# Altium schematic sheet USB.SchDoc
size A4; SheetNumber: 7; SheetTotal: 10
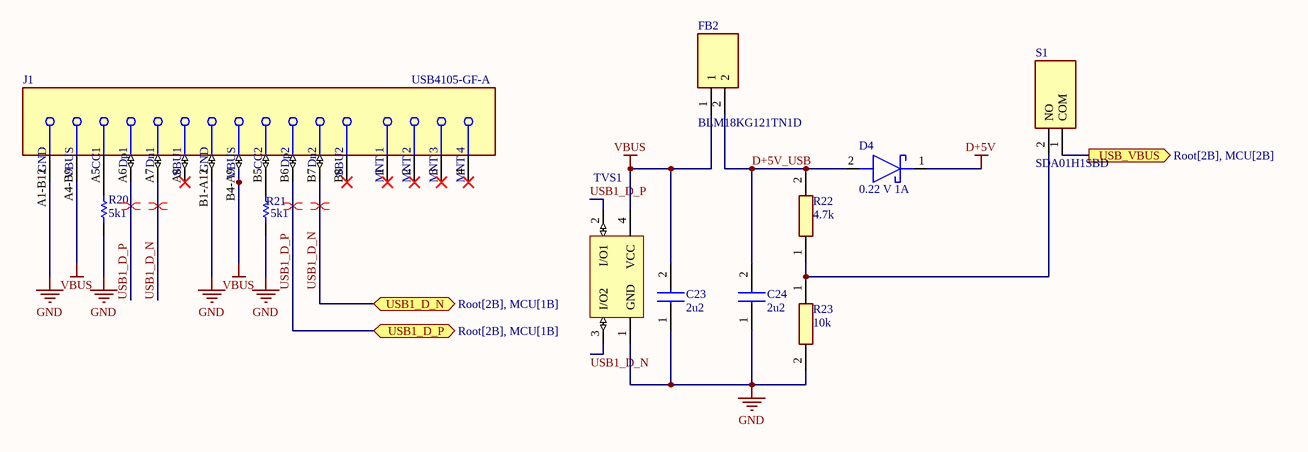
[diagram p0: USB.SchDoc]

## Parts
C23  2u2  [CAPC1608X90N]
C24  2u2  [CAPC1608X90N]
D4  0.22 V 1A  [DIOM5436X330N]
FB2  BLM18KG121TN1D  [BLM18EG101TH1D]
J1  USB4105-GF-A  [FP-USB4105-GF-A-MFG]
R20  Resistance: 5k1  [RESC2013X60X40LL20T25_A]  (hidden comment: ERA-6AEB103V)
R21  Resistance: 5k1  [RESC2013X60X40LL20T25_A]  (hidden comment: ERA-6AEB103V)
R22  4.7k  [RESC1608X55N]
R23  10k  [RESC1608X55N]
S1  SDA01H1SBD  [SDA01H1SBD]
TVS1  PRTR5V0U2X,215  [NXP-SOT143B-4_V]  (value not drawn)

## Ports
USB1_D_N (bidir, see Root[2B], MCU[1B]), USB1_D_P (bidir, see Root[2B], MCU[1B]), USB_VBUS (out, see Root[2B], MCU[2B])

## Nets
D+5V: D4.1(K)
GND: C23.1 C24.1 J1.A1-B12(GND) J1.B1-A12(GND) R20.1 R21.1 R23.2 TVS1.1(GND)
VBUS: C23.2 FB2.1 J1.A4-B9(VBUS) J1.B4-A9(VBUS) TVS1.4(VCC)
D+5V_USB: C24.2 D4.2(A) FB2.2 R22.2
USB1_D_N: J1.A7(Dn1) J1.B7(Dn2) TVS1.3(I/O2) ; port USB1_D_N
USB1_D_P: J1.A6(Dp1) J1.B6(Dp2) TVS1.2(I/O1) ; port USB1_D_P
USB_VBUS: S1.1(COM) ; port USB_VBUS
NetJ1_A5: J1.A5(CC1) R20.2
NetJ1_B5: J1.B5(CC2) R21.2
NetR22_1: R22.1 R23.1 S1.2(NO)

Not connected (* = marked no-connect by the designer): J1 1(MNT_1)* 2(MNT_2)* 3(MNT_3)* 4(MNT_4)* A8(SBU1)* B8(SBU2)*

## Layout directives
differential pair; differential pair class USB1_DIFF: USB1_D_N, USB1_D_P

## Library data of the parts
C23 C24 = CL10B225KP8NNNC: Manufacturer_Name: SAMSUNG; Datasheet Link: https://datasheet.datasheetarchive.com/originals/distributors/Datasheets-DGA10/2411679.pdf; Height: 0.9mm; Manufacturer_Part_Number: CL10B225KP8NNNC; Mouser Part Number: 187-CL10B225KP8NNNC; Mouser Price/Stock: https://www.mouser.co.uk/ProductDetail/Samsung-Electro-Mechanics/CL10B225KP8NNNC?qs=X6jEic%2FHinDbk4bW6Red9A%3D%3D; Arrow Part Number: CL10B225KP8NNNC; Arrow Price/Stock: https://www.arrow.com/en/products/cl10b225kp8nnnc/samsung-electro-mechanics?region=nac
D4 = LSM115JE3_TR13: Manufacturer_Name: Microsemi Corporation; Manufacturer_Part_Number: LSM115JE3/TR13; Datasheet Link: https://media.digikey.com/pdf/Data%20Sheets/Microsemi%20PDFs/LSM115J.pdf; Height: 3.3mm; Mouser Part Number: 494-LSM115JE3/TR13; Mouser Price/Stock: https://www.mouser.co.uk/ProductDetail/Microchip-Microsemi/LSM115JE3-TR13/?qs=6jAvgNDGUA8H9k1qUsKdHA%3D%3D; Arrow Part Number: LSM115JE3/TR13; Arrow Price/Stock: https://www.arrow.com/en/products/lsm115je3tr13/microsemi
FB2 = BLM18KG121TN1D: Ferrite Bead; Manufacturer_Name: Murata Electronics; Datasheet Link: http://www.murata.com/~/media/webrenewal/support/library/catalog/products/emc/emifil/c31e.ashx?la=en-gb; Height: 0.75mm; Manufacturer_Part_Number: BLM18KG121TN1D; Mouser Part Number: 81-BLM18KG121TN1D; Mouser Price/Stock: https://www.mouser.co.uk/ProductDetail/Murata-Electronics/BLM18KG121TN1D?qs=rvfpa0%252BU10PYAwVv0fw24Q%3D%3D; Arrow Part Number: BLM18KG121TN1D; Arrow Price/Stock: https://www.arrow.com/en/products/blm18kg121tn1d/murata-manufacturing?region=nac
J1 = CMP-245163-000001-1: CONN RCPT USB2.0 TYPEC 5A; Manufacturer: GCT; Voltage Rating: 20V; Is Female: yes; Current Rating: 5/6.25/1.25/0.25A; Number Of Contacts: 16; Conn Orientation: Right Angle; Device Class L1: Connectors; Category: Conn; Lead Free: Yes; RoHS: TRUE; Temperature Range High: +85°C; Digikey Description: CONN RCPT USB2.0 TYPEC 5A; Device Class L3: unset; ComponentLink2Description: Datasheet; Manufacturer Part Number: USB4105-GF-A; Package: 0; Usb Standard: USB 2.0; Device Class L2: USB Connectors; Automotive: No; Temperature Range Low: -40°C; Height: 3.46mm; Temperature: -40°C to +85°C; Contact Material: Gold,Nickel; ComponentLink2URL: https://gct.co/files/drawings/usb4105.pdf; Octopart: https://octopart.com/usb4105-gf-a-gct-106627878
R20 R21 = CMP-2001-00582-2: Metal Film Chip Resistor, High Reliability Type, 0.125 W, +/- 0.1%, -55 to 155 degC, 0805 (2012 Metric), RoHS, Tape and Reel; Voltage Rating: 100V; Power Rating: 125mW(1/8W); Brand: Panasonic; Temperature Coefficient: 25PPM/C; Product Category: ThinFilmResistors-SMD; Datasheet Version: 02/2016; Operating Temperature Range: -55Cto+155C; Length: 2mm; Mounting Technology: SurfaceMount; Manufacturer URL: http://www.panasonic.com/; Width: 1.25mm; Packaging: Reel; Product: ThinFilmResistorsSMD; Package / Case: 0805(2012metric); Termination Style: SMD/SMT; Tolerance: 0.1%; Datasheet URL: https://industrial.panasonic.com/cdbs/www-data/pdf/RDM0000/AOA0000C307.pdf; Package Description: 2-Pin Surface Mount Device, Body 2 x 1.25 mm; Factory Pack Quantity: 5000; Series: ERA-6A; Case Code - mm: 2012; RoHS: Details; Package Reference: 0805; Height: 0.5mm; Manufacturer: Panasonic; Case Code - in: 0805; Type: MetalFilmChipResistors
R22 = RC0603FR-074K7L: Manufacturer_Name: YAGEO; Datasheet Link: https://componentsearchengine.com/Datasheets/2/RC0603FR-074K7L.pdf; Height: 0.55mm; Manufacturer_Part_Number: RC0603FR-074K7L; Mouser Part Number: 603-RC0603FR-074K7L; Mouser Price/Stock: https://www.mouser.co.uk/ProductDetail/YAGEO/RC0603FR-074K7L?qs=gt6vzsuosg37y0l7Vt36bQ%3D%3D; Arrow Part Number: RC0603FR-074K7L; Arrow Price/Stock: https://www.arrow.com/en/products/rc0603fr-074k7l/yageo?region=nac
R23 = RC0603FR0710KL: Manufacturer_Name: KEMET; Datasheet Link: http://www.yageo.com/documents/recent/PYu-RC0603_51_RoHS_L_v5.pdf; Height: 0.55mm; Manufacturer_Part_Number: RC0603FR0710KL; Arrow Part Number: RC0603FR0710KL; Arrow Price/Stock: https://www.arrow.com/en/products/rc0603fr-0710kl/yageo
S1 = SDA01H1SBD: Switch; Manufacturer_Name: C & K COMPONENTS; Datasheet Link: https://www.ckswitches.com/media/1327/sda.pdf; Height: 5.45mm; Manufacturer_Part_Number: SDA01H1SBD; Mouser Part Number: 611-SDA01H1SBD; Mouser Price/Stock: https://www.mouser.co.uk/ProductDetail/CK/SDA01H1SBD?qs=Z4wLSx0Y7o7zSPcYp0HxbA%3D%3D; Arrow Part Number: SDA01H1SBD; Arrow Price/Stock: https://www.arrow.com/en/products/sda01h1sbd/ck?region=europe
TVS1 = CMP-2000-05285-1: Ultra Low Capacitance Double Rail-to-Rail ESD Protection Diode, 5.5 V, 1 pF, -40 to 85 degC, 4-Pin SOT143B, RoHS, Tape and Reel; Manufacturer: NXP Semiconductors; Capacitance Value: 16pF; Number of Elements: 1; Rad Hardened: No; Reverse Breakdown Voltage: 6V; Working Voltage (Max): 5.5V; Polarity: Uni-Directional; Configuration: Quad; Leakage Current: 0.1uA; Product Height (mm): 1mm; Suppressor Type: DiodeArrays; Product Length (mm): 3mm; Product Depth (mm): 1.4mm; ESD Protection Voltage: 8KV@ContactDisc; Package Type: SOT; Mounting: SurfaceMount; Packaging: TapeandReel; Datasheet Version: Rev. 02, 01/2008; Reverse Stand-off Voltage: 5.5V; Manufacturer URL: http://www.nxp.com/; Operating Temp Range: -40Cto85C; Operating Temperature Classification: Industrial; Working Voltage: 5.5V; Operating Temperature Min Deg. C: -40C; Datasheet URL: https://datasheet.ciiva.com/4479/prtr5v0u2x-102853-4479461.pdf; Leakage Current (Max): 0.1uA; Direction Type: Uni-Directional; Pin Count: 3+Tab; Operating Temperature Max Deg. C: 85C; Mounting Style: SurfaceMount; Package / Case: SOT